# Altium schematic sheet TK101_Tonegenerator_Hovedkort.SchDoc
size A3; Revision: 6
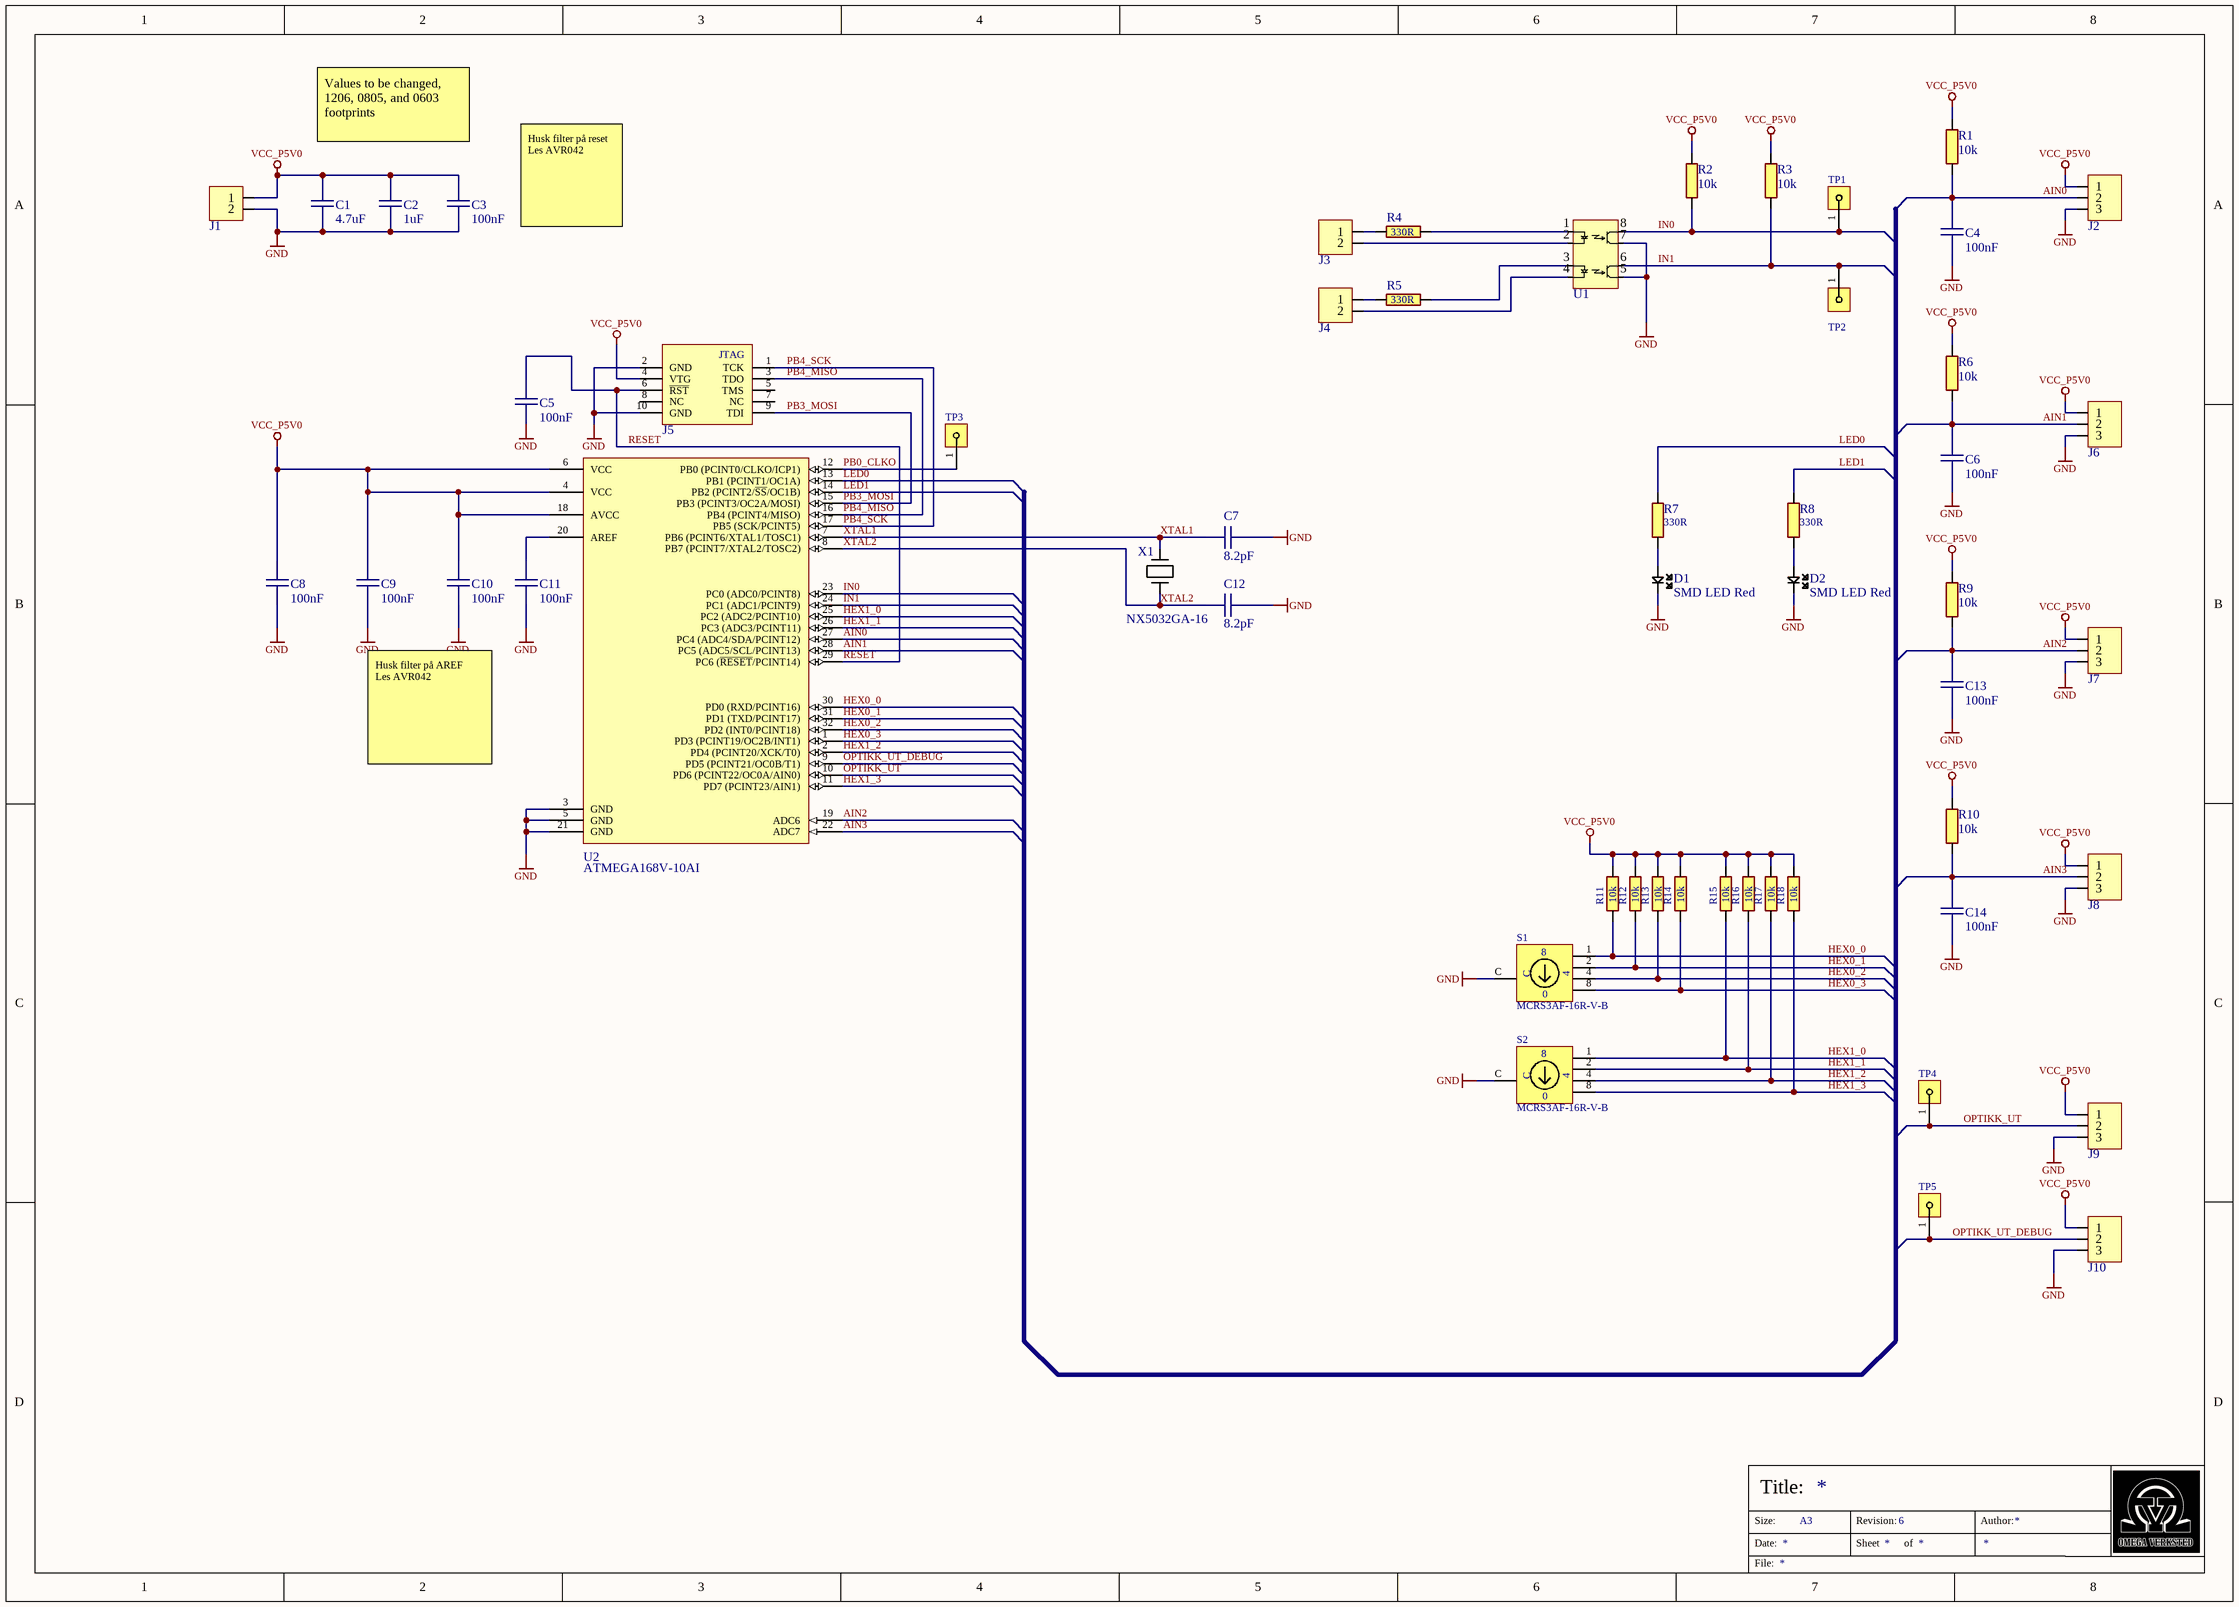
[diagram p0: TK101_Tonegenerator_Hovedkort.SchDoc]

## Parts
C1  4.7uF  [CAPC1206(3216)170_N]
C2  1uF  [CAPC0805(2012)100_N]
C3  100nF  [CAPC0603(1608)55_N]
C4  100nF  [CAPC0603(1608)55_N]
C5  100nF  [CAPC0603(1608)55_N]
C6  100nF  [CAPC0603(1608)55_N]
C7  8.2pF  [CAPC0603(1608)55_N]
C8  100nF  [CAPC0603(1608)55_N]
C9  100nF  [CAPC0603(1608)55_N]
C10  100nF  [CAPC0603(1608)55_N]
C11  100nF  [CAPC0603(1608)55_N]
C12  8.2pF  [CAPC0603(1608)55_N]
C13  100nF  [CAPC0603(1608)55_N]
C14  100nF  [CAPC0603(1608)55_N]
D1  SMD LED Red  [I_LEDC0603(1608)_N]
D2  SMD LED Red  [I_LEDC0603(1608)_N]
J1  JST 2pin  [JST_2P]  (value not drawn)
J2  JST 3pin  [JST_3P]  (value not drawn)
J3  JST 2pin  [JST_2P]  (value not drawn)
J4  JST 2pin  [JST_2P]  (value not drawn)
J5  Header SMD 127 2x5  [SMDHDRV10P127_2X5_615X330X560B]  (value not drawn)
J6  JST 3pin  [JST_3P]  (value not drawn)
J7  JST 3pin  [JST_3P]  (value not drawn)
J8  JST 3pin  [JST_3P]  (value not drawn)
J9  JST 3pin  [JST_3P]  (value not drawn)
J10  JST 3pin  [JST_3P]  (value not drawn)
R1  10k  [RESC0603(1608)_N]
R2  10k  [RESC0603(1608)_N]
R3  10k  [RESC0603(1608)_N]
R4  330R  [RESC0603(1608)_N]
R5  330R  [RESC0603(1608)_N]
R6  10k  [RESC0603(1608)_N]
R7  330R  [RESC0603(1608)_N]
R8  330R  [RESC0603(1608)_N]
R9  10k  [RESC0603(1608)_N]
R10  10k  [RESC0603(1608)_N]
R11  10k  [RESC0603(1608)_N]
R12  10k  [RESC0603(1608)_N]
R13  10k  [RESC0603(1608)_N]
R14  10k  [RESC0603(1608)_N]
R15  10k  [RESC0603(1608)_N]
R16  10k  [RESC0603(1608)_N]
R17  10k  [RESC0603(1608)_N]
R18  10k  [RESC0603(1608)_N]
S1  MCRS3AF-16R-V-B  [MCRS3AF-16R-V-B]
S2  MCRS3AF-16R-V-B  [MCRS3AF-16R-V-B]
TP1  Header1x1  [HDRV1W64P254_1X1_254X254X900B]  (value not drawn)
TP2  Header1x1  [HDRV1W64P254_1X1_254X254X900B]  (value not drawn)
TP3  Header1x1  [HDRV1W64P254_1X1_254X254X900B]  (value not drawn)
TP4  Header1x1  [HDRV1W64P254_1X1_254X254X900B]  (value not drawn)
TP5  Header1x1  [HDRV1W64P254_1X1_254X254X900B]  (value not drawn)
U1  Dual_Optocoupler  [SOIC127P590X363-8N]  (value not drawn)
U2  ATMEGA168V-10AI  [TQFP80P900X900X120-32N]
X1  NX5032GA-16  [CRYSTAL-ABM7]

## Nets
GND: C1.1 C2.1 C3.1 C4.1 C5.1 C6.1 C7.1 C8.2 C9.2 C10.1 C11.1 C12.1 C13.1 C14.1 D1.2 D2.2 J1.2 J2.3 J5.2(GND) J5.10(GND) J6.3 J7.3 J8.3 J9.3 J10.3 S1.C S2.C U1.5 U1.7 U2.3(GND) U2.5(GND) U2.21(GND)
VCC_P5V0: C1.2 C2.2 C3.2 C8.1 C9.1 C10.2 J1.1 J2.1 J5.4(VTG) J6.1 J7.1 J8.1 J9.1 J10.1 R1.2 R2.2 R3.2 R6.2 R9.2 R10.2 R11.2 R12.2 R13.2 R14.2 R15.2 R16.2 R17.2 R18.2 U2.4(VCC) U2.6(VCC) U2.18(AVCC)
AIN0: C4.2 J2.2 R1.1 U2.27(PC4_(ADC4/SDA/PCINT12))
AIN1: C6.2 J6.2 R6.1 U2.28(PC5_(ADC5/SCL/PCINT13))
AIN2: C13.2 J7.2 R9.1 U2.19(ADC6)
AIN3: C14.2 J8.2 R10.1 U2.22(ADC7)
HEX0_0: R11.1 S1.1 U2.30(PD0_(RXD/PCINT16))
HEX0_1: R12.1 S1.2 U2.31(PD1_(TXD/PCINT17))
HEX0_2: R13.1 S1.4 U2.32(PD2_(INT0/PCINT18))
HEX0_3: R14.1 S1.8 U2.1(PD3_(PCINT19/OC2B/INT1))
HEX1_0: R15.1 S2.1 U2.25(PC2_(ADC2/PCINT10))
HEX1_1: R16.1 S2.2 U2.26(PC3_(ADC3/PCINT11))
HEX1_2: R17.1 S2.4 U2.2(PD4_(PCINT20/XCK/T0))
HEX1_3: R18.1 S2.8 U2.11(PD7_(PCINT23/AIN1))
IN0: R2.1 TP1.1 U1.8 U2.23(PC0_(ADC0/PCINT8))
IN1: R3.1 TP2.1 U1.6 U2.24(PC1_(ADC1/PCINT9))
LED0: R7.2 U2.13(PB1_(PCINT1/OC1A))
LED1: R8.2 U2.14(PB2_(PCINT2/~{SS}/OC1B))
OPTIKK_UT: J9.2 TP4.1 U2.10(PD6_(PCINT22/OC0A/AIN0))
OPTIKK_UT_DEBUG: J10.2 TP5.1 U2.9(PD5_(PCINT21/OC0B/T1))
PB0_CLKO: TP3.1 U2.12(PB0_(PCINT0/CLKO/ICP1))
PB3_MOSI: J5.9(TDI) U2.15(PB3_(PCINT3/OC2A/MOSI))
PB4_MISO: J5.3(TDO) U2.16(PB4_(PCINT4/MISO))
PB4_SCK: J5.1(TCK) U2.17(PB5_(SCK/PCINT5))
RESET: C5.2 J5.6(~{RST}) U2.29(PC6_(~{RESET}/PCINT14))
XTAL1: C7.2 U2.7(PB6_(PCINT6/XTAL1/TOSC1)) X1.1
XTAL2: C12.2 U2.8(PB7_(PCINT7/XTAL2/TOSC2)) X1.2
NetC11_2: C11.2 U2.20(AREF)
NetD1_1: D1.1 R7.1
NetD2_1: D2.1 R8.1
NetJ3_1: J3.1 R4.1
NetJ3_2: J3.2 U1.2
NetJ4_1: J4.1 R5.1
NetJ4_2: J4.2 U1.4
NetR4_2: R4.2 U1.1
NetR5_2: R5.2 U1.3

Not connected (* = marked no-connect by the designer): J5 5(TMS) 7(NC) 8(NC)

## Notes on the sheet
- Values to be changed, 1206, 0805, and 0603 footprints
- Husk filter på reset
  Les AVR042
- Husk filter på AREF
  Les AVR042
- Size:
- Date:
- Title:
- A3
- Revision:
- Sheet
- of
- Author:
- File:
- (in symbol 3765) 0

## Library data of the parts
C1 = 2992: X7R 50V; id: 2992; pakke_opprettet_av: 815; pakke_opprettet: 11.02.2015 13.21.22; symbol_opprettet: 14.11.2014 20.19.34; pris: 1; nokkelord: Kondensator, capacitor; produsent: Multikomp; pakketype: 1206; symbol_opprettet_av: 815; navn: 4.7uF
C2 = 3582: X7R 50V 10%; id: 3582; pakke_opprettet_av: 815; pakke_opprettet: 14.11.2014 20.52.01; symbol_opprettet: 14.11.2014 20.19.34; leverandor_varenr: 1735541; pris: 4; nokkelord: Kondensator, capacitor; produsent: Murata; leverandor: Farnell; pakketype: 0805; symbol_opprettet_av: 815; navn: 1uF
C3 C4 C6 C13 C14 = 3028: X7R 50V 5%; id: 3028; pakke_opprettet_av: 815; pakke_opprettet: 18.02.2015 14.18.13; symbol_opprettet: 14.11.2014 20.19.34; leverandor_varenr: 1759122; pris: 1; nokkelord: Kondensator, Capacitor, CAP; produsent: Multikomp; leverandor: Farnell; pakketype: 0603; symbol_opprettet_av: 815; navn: 100nF
C5 C8-C11 = 3028: X7R 50V 5%; id: 3028; pakke_opprettet_av: 815; leverandor_varenr: 1759122; pris: 1; nokkelord: Kondensator, Capacitor, CAP; produsent: Multikomp; leverandor: Farnell; pakketype: 0603; pakke_opprettet: 18.02.2015 14:18:13; symbol_opprettet_av: 815; symbol_opprettet: 14.11.2014 20:19:34; navn: 100nF
C7 C12 = 3032: NP0 50V 5%; id: 3032; pakke_opprettet_av: 815; leverandor_varenr: 2434642; pris: 1; nokkelord: Kondensator, Capacitor, CAP; produsent: Murata; leverandor: Farnell; pakketype: 0603; pakke_opprettet: 18.02.2015 14:18:13; symbol_opprettet_av: 815; symbol_opprettet: 14.11.2014 20:19:34; navn: 8.2pF
D1 D2 = 2209: id: 2209; rad: 0; rom: OV; lager_type: Fremlager; dybde: 2; hylle: 13; antall: 50; pakke_opprettet_av: 815; pakke_opprettet: 06.07.2014 18.55.44; symbol_opprettet: 06.07.2014 18.59.47; leverandor_varenr: 8554641; pris: 1; produsent: Avago; leverandor: Farnell; pakketype: 0603; kolonne: 0; symbol_opprettet_av: 815; beskrivelse: SMD; navn: SMD LED Red; nokkelord: SMD
J1 J3 J4 = 2227: pris pr. stk.; id: 2227; pakke_opprettet_av: 815; pris: 2; nokkelord: Connector, Kontakt; pakketype: TH; pakke_opprettet: 28.06.2014 18:25:03; symbol_opprettet_av: 815; symbol_opprettet: 28.06.2014 15:33:17; navn: JST 2pin
J2 J6-J10 = 2226: pris pr. stk.; id: 2226; pakke_opprettet_av: 815; pris: 2; nokkelord: Connector, Kontakt; pakketype: TH; pakke_opprettet: 28.06.2014 18:25:12; symbol_opprettet_av: 815; symbol_opprettet: 28.06.2014 15:33:24; navn: JST 3pin
J5 = 2449: 1,27mm Pitch SMD Header; id: 2449; pakke_opprettet_av: 815; pris: 20; nokkelord: JTAG; pakke_opprettet: 15.11.2014 18:30:38; symbol_opprettet_av: 815; symbol_opprettet: 15.11.2014 18:33:29; navn: Header SMD 127 2x5; pakketype: SMD
R1-R3 R6 R9-R18 = 2444: 0.1W 1% Thick film resistor; id: 2444; rad: -1; rom: OV; lager_type: Fremlager; dybde: 72; hylle: 6; antall: 100; kolonne: 0; pakke_opprettet_av: 815; pakke_opprettet: 08.07.2014 21.15.30; symbol_opprettet: 08.07.2014 21.16.33; leverandor_varenr: 2447230; nokkelord: Resistor Motstand; produsent: Multikomp; leverandor: Farnell; pakketype: 0603; symbol_opprettet_av: 815; navn: 10k; pris: 0
R4 R5 R7 R8 = 2448: 0.1W 1% Thick film resistor; id: 2448; rad: -1; rom: OV; lager_type: Fremlager; dybde: 36; hylle: 6; antall: 100; kolonne: 0; pakke_opprettet_av: 815; pakke_opprettet: 08.07.2014 21.15.30; symbol_opprettet: 08.07.2014 21.16.33; nokkelord: Resistor Motstand; pakketype: 0603; symbol_opprettet_av: 815; navn: 330R; pris: 0
S1 S2 = 3765: Rotary hex switch; id: 3765; pakke_opprettet_av: 815; pakke_opprettet: 16.09.2016 20.12.26; symbol_opprettet: 16.09.2016 20.35.40; leverandor_varenr: 2083018; pris: 13; nokkelord: encoder; produsent: Multikomp; leverandor: Farnell; pakketype: TH; symbol_opprettet_av: 815; navn: MCRS3AF-16R-V-B
TP1-TP5 = 2428: id: 2428; pakke_opprettet_av: 815; beskrivelse: 2,54mm pitch; pris: 1; pakketype: TH; pakke_opprettet: 13.11.2014 12:30:32; symbol_opprettet_av: 815; symbol_opprettet: 13.11.2014 10:58:46; navn: Header 1x1
U1 = 2379: Dual Optocoupler; id: 2379; pakke_opprettet_av: 774; symbol_opprettet_av: 815; leverandor_varenr: 1086672; navn: MOCD207R2M; pris: 4; produsent: Fairchild; leverandor: Farnell; pakketype: SOIC; pakke_opprettet: 23.08.2014 14:54:32; symbol_opprettet: 28.06.2014 15:40:47
U2 = 2242: id: 2242; rad: 1; rom: OV; lager_type: Fremlager; dybde: 2; antall: 100; kolonne: 3; pakke_opprettet_av: 1335; beskrivelse: Mikrokontroller; pris: 0; produsent: Atmel; pakketype: TQFP; hylle: 1; pakke_opprettet: 11.03.2016 13:28:05; symbol_opprettet_av: 1335; symbol_opprettet: 11.03.2016 13:26:28; navn: ATMEGA168V-10AI
X1 = 1594: Crystal 16 MHz; id: 1594; rad: 0; rom: OV; lager_type: Fremlager; dybde: 1; hylle: 2; antall: 42; kolonne: 3; pakke_opprettet_av: 774; leverandor_varenr: 644-1135-1-ND; pris: 5; nokkelord: xtal, oscillator; produsent: NDK; leverandor: DigiKey; pakketype: SMD; pakke_opprettet: 23.08.2014 20:10:40; symbol_opprettet_av: 774; symbol_opprettet: 23.08.2014 20:23:20; navn: NX5032GA-16